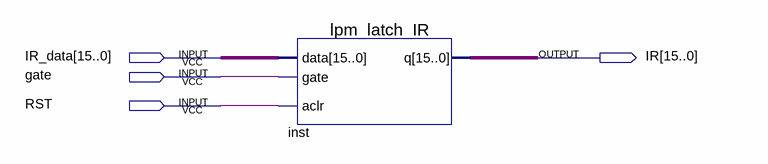
[diagram p0: schematic sheet]
// Quartus schematic IR.bdf as structural Verilog: 1 symbols, 4 pins
module IR (
  input  [15:0] IR_data,
  input  gate,
  input  RST,
  output [15:0] IR
);

  lpm_latch_IR inst (.data(IR_data), .gate(gate), .aclr(RST), .q(IR));
endmodule
